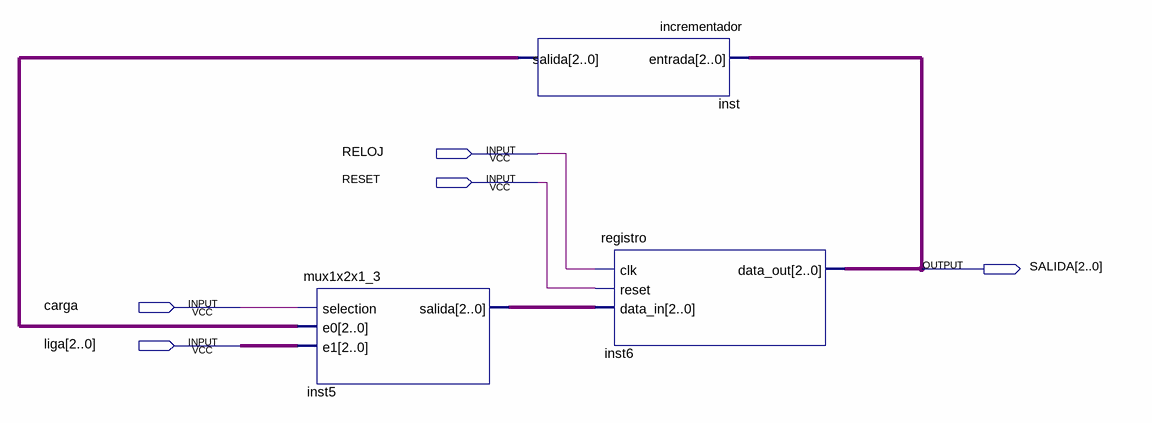
[diagram p0: schematic sheet]
// Quartus schematic contador.bdf as structural Verilog: 3 symbols, 5 pins
module contador (
  input  RELOJ,
  input  RESET,
  input  carga,
  input  [2:0] liga,
  output [2:0] SALIDA
);

  wire [2:0] inst5_salida, inst_salida;

  mux1x2x1_3 inst5 (.selection(carga), .e0(inst_salida), .e1(liga), .salida(inst5_salida));
  incrementador inst (.entrada(SALIDA), .salida(inst_salida));
  registro inst6 (.clk(RELOJ), .reset(RESET), .data_in(inst5_salida), .data_out(SALIDA));
endmodule
